# Altium schematic sheet kam_rx.SchDoc
size A2
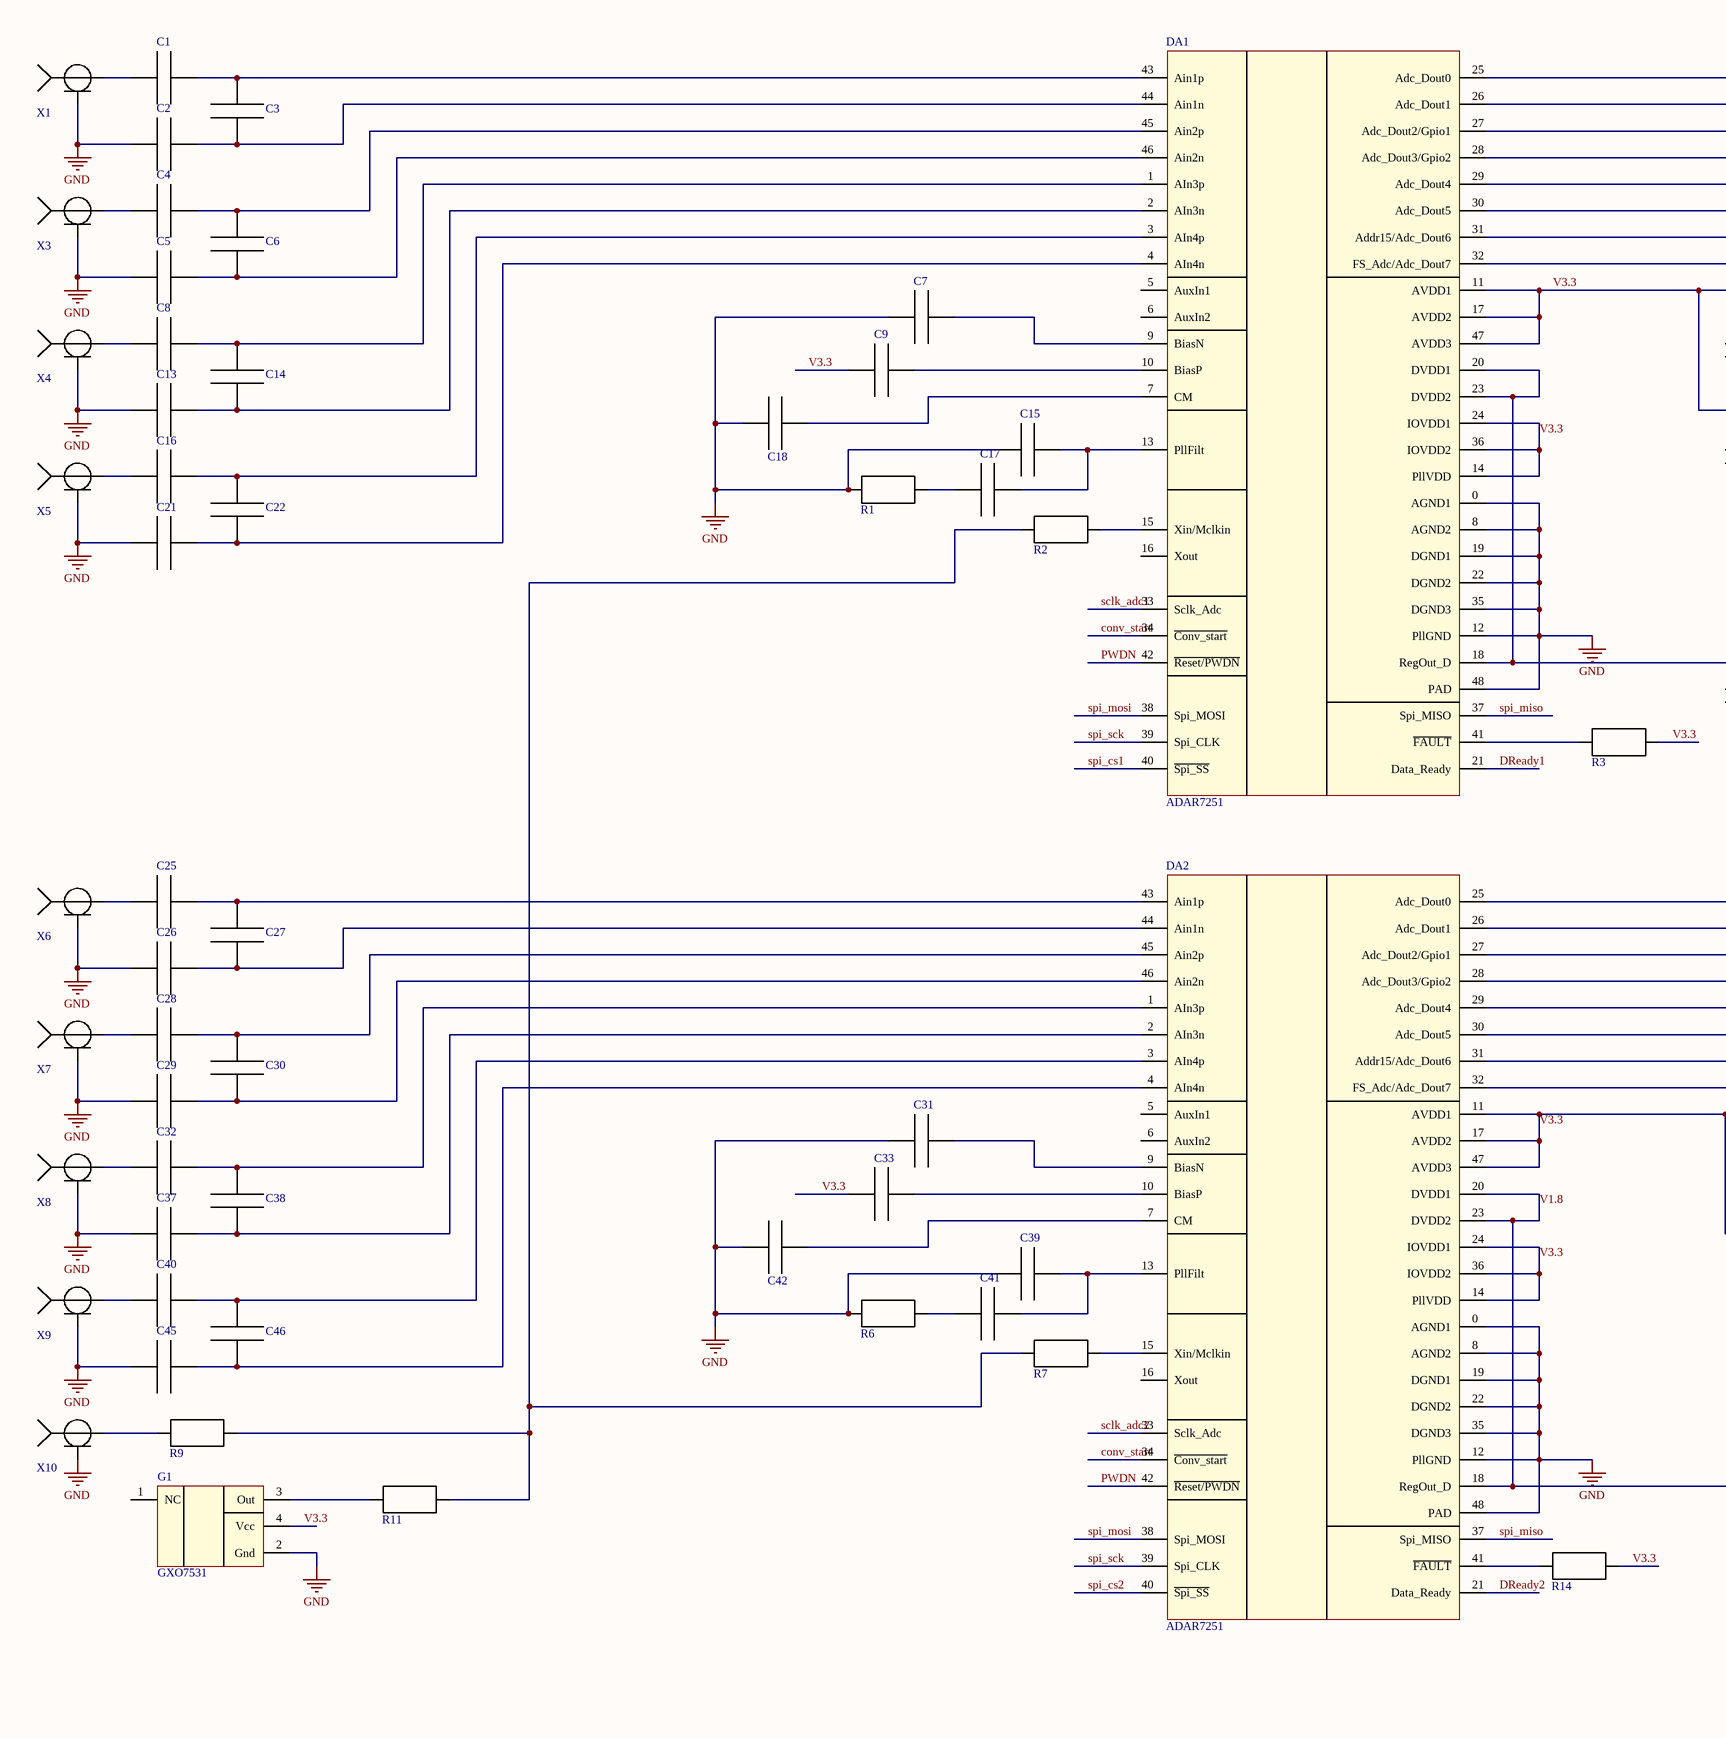
[diagram p0: kam_rx.SchDoc, left]
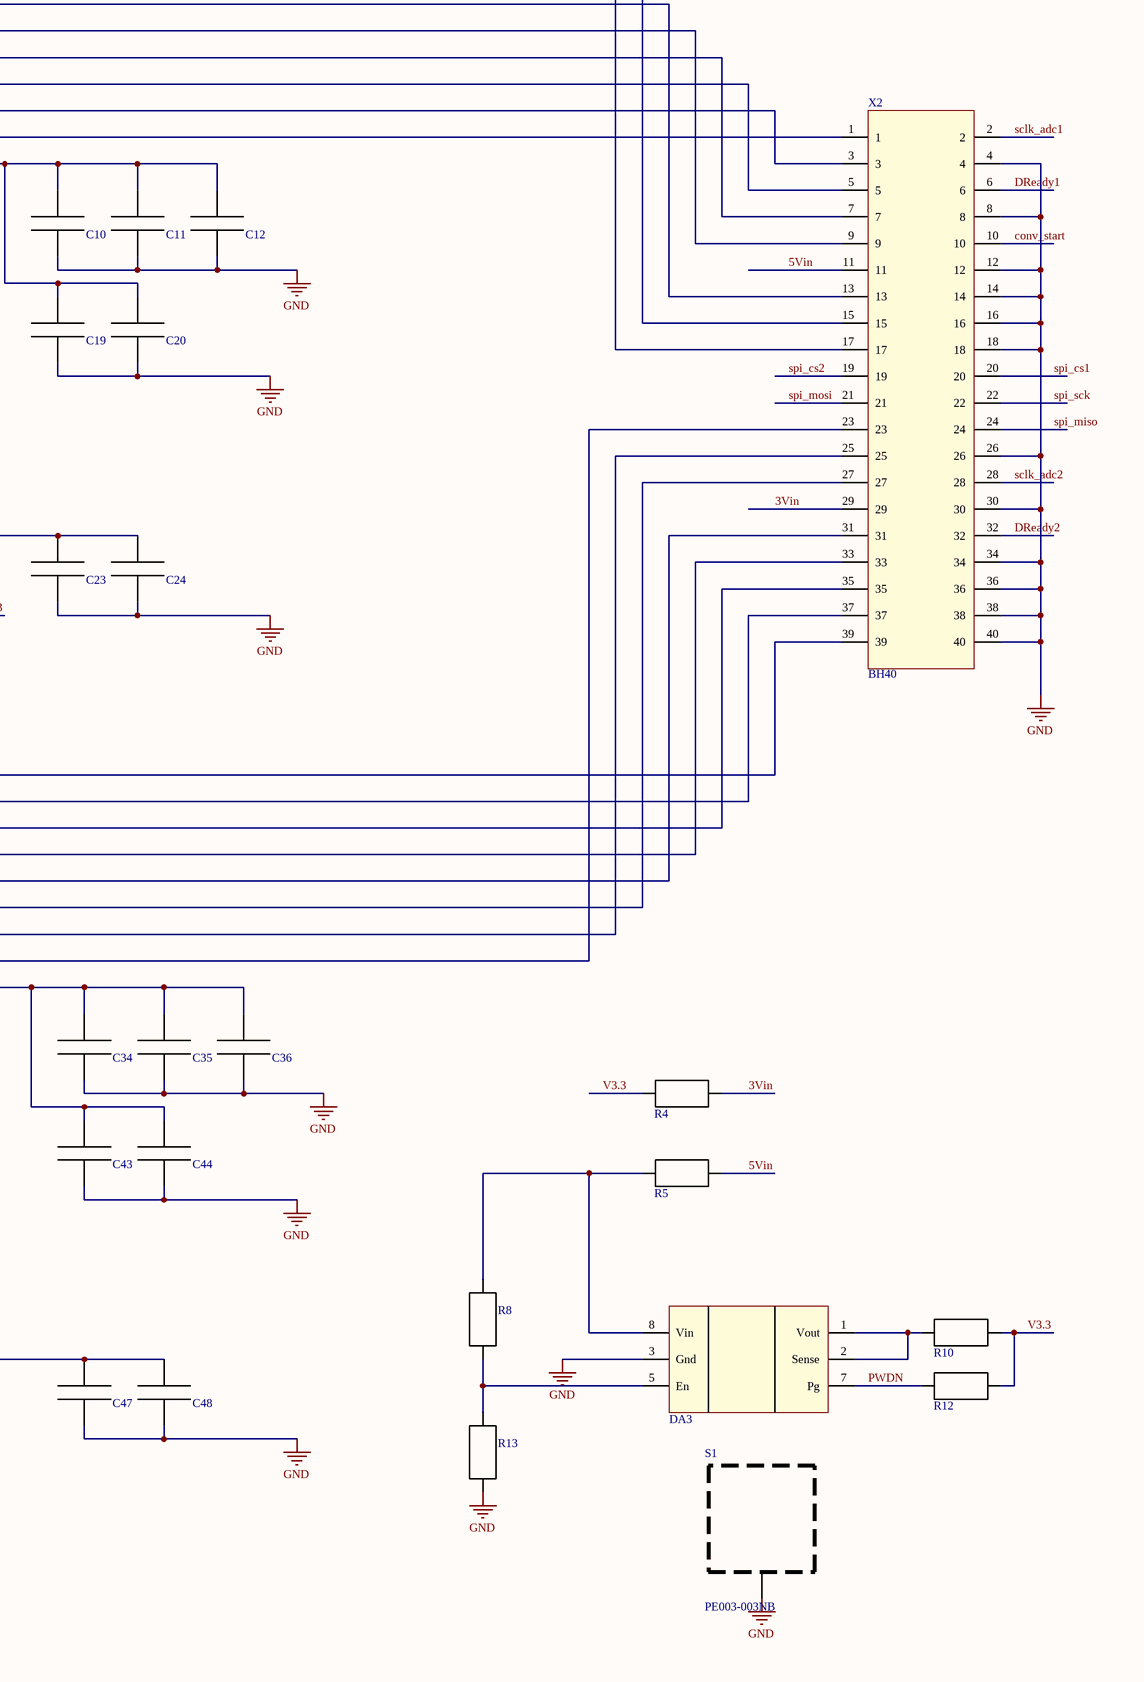
[diagram p1: kam_rx.SchDoc, right]

## Parts
C1  C0603  [CAPC1608X06N]  (value not drawn)
C2  C0603  [CAPC1608X06N]  (value not drawn)
C3  C0603  [CAPC1608X06N]  (value not drawn)
C4  C0603  [CAPC1608X06N]  (value not drawn)
C5  C0603  [CAPC1608X06N]  (value not drawn)
C6  C0603  [CAPC1608X06N]  (value not drawn)
C7  C0603  [CAPC1608X06N]  (value not drawn)
C8  C0603  [CAPC1608X06N]  (value not drawn)
C9  C0603  [CAPC1608X06N]  (value not drawn)
C10  C0603  [CAPC1608X06N]  (value not drawn)
C11  C0603  [CAPC1608X06N]  (value not drawn)
C12  C0603  [CAPC1608X06N]  (value not drawn)
C13  C0603  [CAPC1608X06N]  (value not drawn)
C14  C0603  [CAPC1608X06N]  (value not drawn)
C15  C0603  [CAPC1608X06N]  (value not drawn)
C16  C0603  [CAPC1608X06N]  (value not drawn)
C17  C0603  [CAPC1608X06N]  (value not drawn)
C18  C0603  [CAPC1608X06N]  (value not drawn)
C19  C0603  [CAPC1608X06N]  (value not drawn)
C20  C0603  [CAPC1608X06N]  (value not drawn)
C21  C0603  [CAPC1608X06N]  (value not drawn)
C22  C0603  [CAPC1608X06N]  (value not drawn)
C23  C0603  [CAPC1608X06N]  (value not drawn)
C24  C0603  [CAPC1608X06N]  (value not drawn)
C25  C0603  [CAPC1608X06N]  (value not drawn)
C26  C0603  [CAPC1608X06N]  (value not drawn)
C27  C0603  [CAPC1608X06N]  (value not drawn)
C28  C0603  [CAPC1608X06N]  (value not drawn)
C29  C0603  [CAPC1608X06N]  (value not drawn)
C30  C0603  [CAPC1608X06N]  (value not drawn)
C31  C0603  [CAPC1608X06N]  (value not drawn)
C32  C0603  [CAPC1608X06N]  (value not drawn)
C33  C0603  [CAPC1608X06N]  (value not drawn)
C34  C0603  [CAPC1608X06N]  (value not drawn)
C35  C0603  [CAPC1608X06N]  (value not drawn)
C36  C0603  [CAPC1608X06N]  (value not drawn)
C37  C0603  [CAPC1608X06N]  (value not drawn)
C38  C0603  [CAPC1608X06N]  (value not drawn)
C39  C0603  [CAPC1608X06N]  (value not drawn)
C40  C0603  [CAPC1608X06N]  (value not drawn)
C41  C0603  [CAPC1608X06N]  (value not drawn)
C42  C0603  [CAPC1608X06N]  (value not drawn)
C43  C0603  [CAPC1608X06N]  (value not drawn)
C44  C0603  [CAPC1608X06N]  (value not drawn)
C45  C0603  [CAPC1608X06N]  (value not drawn)
C46  C0603  [CAPC1608X06N]  (value not drawn)
C47  C0603  [CAPC1608X06N]  (value not drawn)
C48  C0603  [CAPC1608X06N]  (value not drawn)
DA1  ADAR7251  [PQFN50P700X700X100_HS-49N]
DA2  ADAR7251  [PQFN50P700X700X100_HS-49N]
DA3  ADP7104  [SOIC127P600X165_HS-9N]  (value not drawn)
G1  GXO7531  [DFN400P700X145-4N]
R1  R0603  [RESC1608X06N]  (value not drawn)
R2  R0603  [RESC1608X06N]  (value not drawn)
R3  R0603  [RESC1608X06N]  (value not drawn)
R4  R0603  [RESC1608X06N]  (value not drawn)
R5  R0603  [RESC1608X06N]  (value not drawn)
R6  R0603  [RESC1608X06N]  (value not drawn)
R7  R0603  [RESC1608X06N]  (value not drawn)
R8  R0603  [RESC1608X06N]  (value not drawn)
R9  R0603  [RESC1608X06N]  (value not drawn)
R10  R0603  [RESC1608X06N]  (value not drawn)
R11  R0603  [RESC1608X06N]  (value not drawn)
R12  R0603  [RESC1608X06N]  (value not drawn)
R13  R0603  [RESC1608X06N]  (value not drawn)
R14  R0603  [RESC1608X06N]  (value not drawn)
S1  PE003-003NB  [PE003-003NB]
X1  MCX 1085221-1  [MCX]  (value not drawn)
X2  BH40  [BH40]
X3  MCX 1085221-1  [MCX]  (value not drawn)
X4  MCX 1085221-1  [MCX]  (value not drawn)
X5  MCX 1085221-1  [MCX]  (value not drawn)
X6  MCX 1085221-1  [MCX]  (value not drawn)
X7  MCX 1085221-1  [MCX]  (value not drawn)
X8  MCX 1085221-1  [MCX]  (value not drawn)
X9  MCX 1085221-1  [MCX]  (value not drawn)
X10  MCX 1085221-1  [MCX]  (value not drawn)

## Nets
GND: C2.1 C5.1 C7.1 C10.2 C11.2 C12.2 C13.1 C15.1 C18.2 C19.2 C20.2 C21.1 C23.2 C24.2 C26.1 C29.1 C31.1 C34.2 C35.2 C36.2 C37.1 C39.1 C42.2 C43.2 C44.2 C45.1 C47.2 C48.2 DA1.0(AGND1) DA1.8(AGND2) DA1.12(PllGND) DA1.19(DGND1) DA1.22(DGND2) DA1.35(DGND3) DA1.48(PAD) DA2.0(AGND1) DA2.8(AGND2) DA2.12(PllGND) DA2.19(DGND1) DA2.22(DGND2) DA2.35(DGND3) DA2.48(PAD) DA3.3(Gnd) G1.2(Gnd) R1.2 R6.2 R13.2 S1.0 X1.2 X2.4 X2.8 X2.12 X2.14 X2.16 X2.18 X2.26 X2.30 X2.34 X2.36 X2.38 X2.40 X3.2 X4.2 X5.2 X6.2 X7.2 X8.2 X9.2 X10.2
3Vin: R4.1 X2.29
5Vin: R5.1 X2.11
conv_start: DA1.34(~{Conv_start}) DA2.34(~{Conv_start}) X2.10
DReady1: DA1.21(Data_Ready) X2.6
DReady2: DA2.21(Data_Ready) X2.32
PWDN: DA1.42(~{Reset/PWDN}) DA2.42(~{Reset/PWDN}) DA3.7(Pg) R12.2
sclk_adc1: DA1.33(Sclk_Adc) X2.2
sclk_adc2: DA2.33(Sclk_Adc) X2.28
spi_cs1: DA1.40(~{Spi_SS}) X2.20
spi_cs2: DA2.40(~{Spi_SS}) X2.19
spi_miso: DA1.37(Spi_MISO) DA2.37(Spi_MISO) X2.24
spi_mosi: DA1.38(Spi_MOSI) DA2.38(Spi_MOSI) X2.21
spi_sck: DA1.39(Spi_CLK) DA2.39(Spi_CLK) X2.22
V1.8: C47.1 C48.1 DA2.18(RegOut_D) DA2.20(DVDD1) DA2.23(DVDD2)
V3.3: C9.1 C10.1 C11.1 C12.1 C19.1 C20.1 C33.1 C34.1 C35.1 C36.1 C43.1 C44.1 DA1.11(AVDD1) DA1.14(PllVDD) DA1.17(AVDD2) DA1.24(IOVDD1) DA1.36(IOVDD2) DA1.47(AVDD3) DA2.11(AVDD1) DA2.14(PllVDD) DA2.17(AVDD2) DA2.24(IOVDD1) DA2.36(IOVDD2) DA2.47(AVDD3) G1.4(Vcc) R3.1 R4.2 R10.1 R12.1 R14.1
NetC1_1: C1.1 X1.1
NetC1_2: C1.2 C3.2 DA1.43(Ain1p)
NetC2_2: C2.2 C3.1 DA1.44(Ain1n)
NetC4_1: C4.1 X3.1
NetC4_2: C4.2 C6.2 DA1.45(Ain2p)
NetC5_2: C5.2 C6.1 DA1.46(Ain2n)
NetC7_2: C7.2 DA1.9(BiasN)
NetC8_1: C8.1 X4.1
NetC8_2: C8.2 C14.2 DA1.1(AIn3p)
NetC9_2: C9.2 DA1.10(BiasP)
NetC13_2: C13.2 C14.1 DA1.2(AIn3n)
NetC15_2: C15.2 C17.2 DA1.13(PllFilt)
NetC16_1: C16.1 X5.1
NetC16_2: C16.2 C22.2 DA1.3(AIn4p)
NetC17_1: C17.1 R1.1
NetC18_1: C18.1 DA1.7(CM)
NetC21_2: C21.2 C22.1 DA1.4(AIn4n)
NetC23_1: C23.1 C24.1 DA1.18(RegOut_D) DA1.20(DVDD1) DA1.23(DVDD2)
NetC25_1: C25.1 X6.1
NetC25_2: C25.2 C27.2 DA2.43(Ain1p)
NetC26_2: C26.2 C27.1 DA2.44(Ain1n)
NetC28_1: C28.1 X7.1
NetC28_2: C28.2 C30.2 DA2.45(Ain2p)
NetC29_2: C29.2 C30.1 DA2.46(Ain2n)
NetC31_2: C31.2 DA2.9(BiasN)
NetC32_1: C32.1 X8.1
NetC32_2: C32.2 C38.2 DA2.1(AIn3p)
NetC33_2: C33.2 DA2.10(BiasP)
NetC37_2: C37.2 C38.1 DA2.2(AIn3n)
NetC39_2: C39.2 C41.2 DA2.13(PllFilt)
NetC40_1: C40.1 X9.1
NetC40_2: C40.2 C46.2 DA2.3(AIn4p)
NetC41_1: C41.1 R6.1
NetC42_1: C42.1 DA2.7(CM)
NetC45_2: C45.2 C46.1 DA2.4(AIn4n)
NetDA1_15: DA1.15(Xin/Mclkin) R2.1
NetDA1_25: DA1.25(Adc_Dout0) X2.17
NetDA1_26: DA1.26(Adc_Dout1) X2.15
NetDA1_27: DA1.27(Adc_Dout2/Gpio1) X2.13
NetDA1_28: DA1.28(Adc_Dout3/Gpio2) X2.9
NetDA1_29: DA1.29(Adc_Dout4) X2.7
NetDA1_30: DA1.30(Adc_Dout5) X2.5
NetDA1_31: DA1.31(Addr15/Adc_Dout6) X2.3
NetDA1_32: DA1.32(FS_Adc/Adc_Dout7) X2.1
NetDA1_41: DA1.41(~{FAULT}) R3.2
NetDA2_15: DA2.15(Xin/Mclkin) R7.1
NetDA2_25: DA2.25(Adc_Dout0) X2.39
NetDA2_26: DA2.26(Adc_Dout1) X2.37
NetDA2_27: DA2.27(Adc_Dout2/Gpio1) X2.35
NetDA2_28: DA2.28(Adc_Dout3/Gpio2) X2.33
NetDA2_29: DA2.29(Adc_Dout4) X2.31
NetDA2_30: DA2.30(Adc_Dout5) X2.27
NetDA2_31: DA2.31(Addr15/Adc_Dout6) X2.25
NetDA2_32: DA2.32(FS_Adc/Adc_Dout7) X2.23
NetDA2_41: DA2.41(~{FAULT}) R14.2
NetDA3_1: DA3.1(Vout) DA3.2(Sense) R10.2
NetDA3_5: DA3.5(En) R8.2 R13.1
NetDA3_8: DA3.8(Vin) R5.2 R8.1
NetG1_3: G1.3(Out) R11.2
NetR2_2: R2.2 R7.2 R9.1 R11.1
NetR9_2: R9.2 X10.1

Not connected (* = marked no-connect by the designer): DA1 5(AuxIn1) 6(AuxIn2) 16(Xout); DA2 5(AuxIn1) 6(AuxIn2) 16(Xout); G1 1(NC)